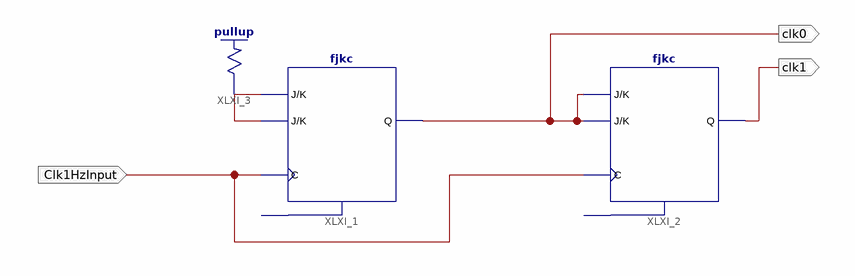
[diagram p0: schematic sheet 1]
// Xilinx ISE schematic DivBy2ClkHz.sch (spartan3e) as structural Verilog: 3 symbols, 3 ports
module DivBy2ClkHz (
  input  Clk1HzInput,
  output clk0,
  output clk1
);

  wire XLXN_8;

  fjkc XLXI_1 (.C(Clk1HzInput), .J(XLXN_8), .K(XLXN_8), .Q(clk0));  // open: CLR
  fjkc XLXI_2 (.C(Clk1HzInput), .J(clk0), .K(clk0), .Q(clk1));  // open: CLR
  \pullup  XLXI_3 (.O(XLXN_8));
endmodule
